# EAGLE schematic schematic-version5 - Jingbin (EAGLE 8.6.0)
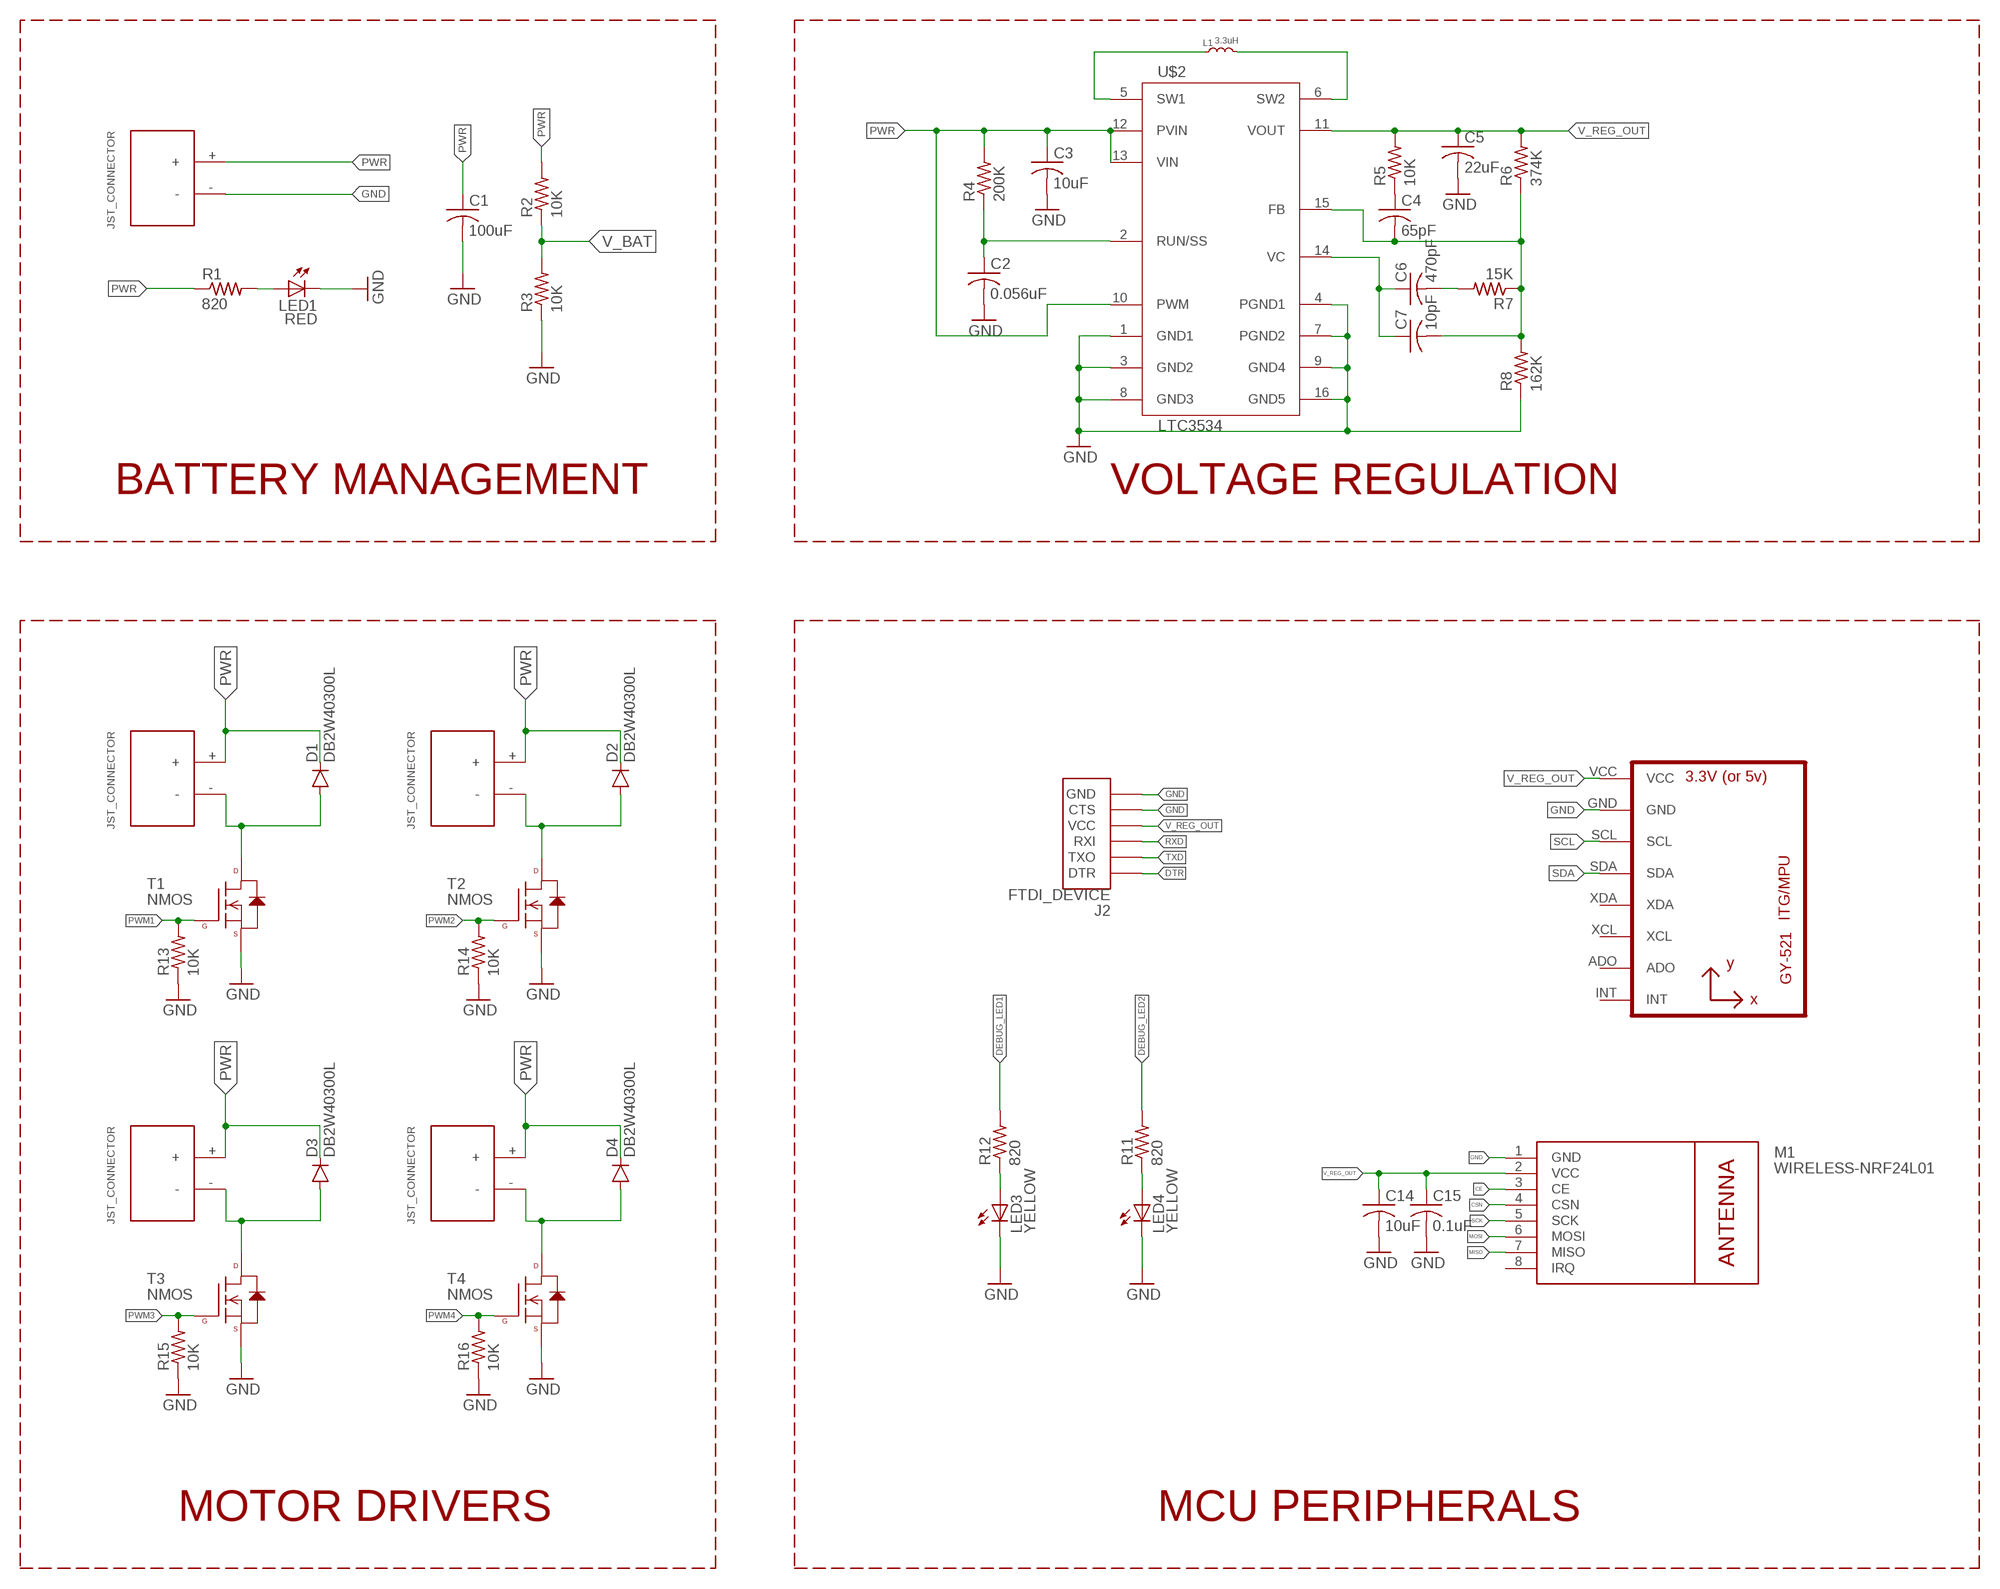
[diagram p0: schematic, sheet 1, part 1 of 2]
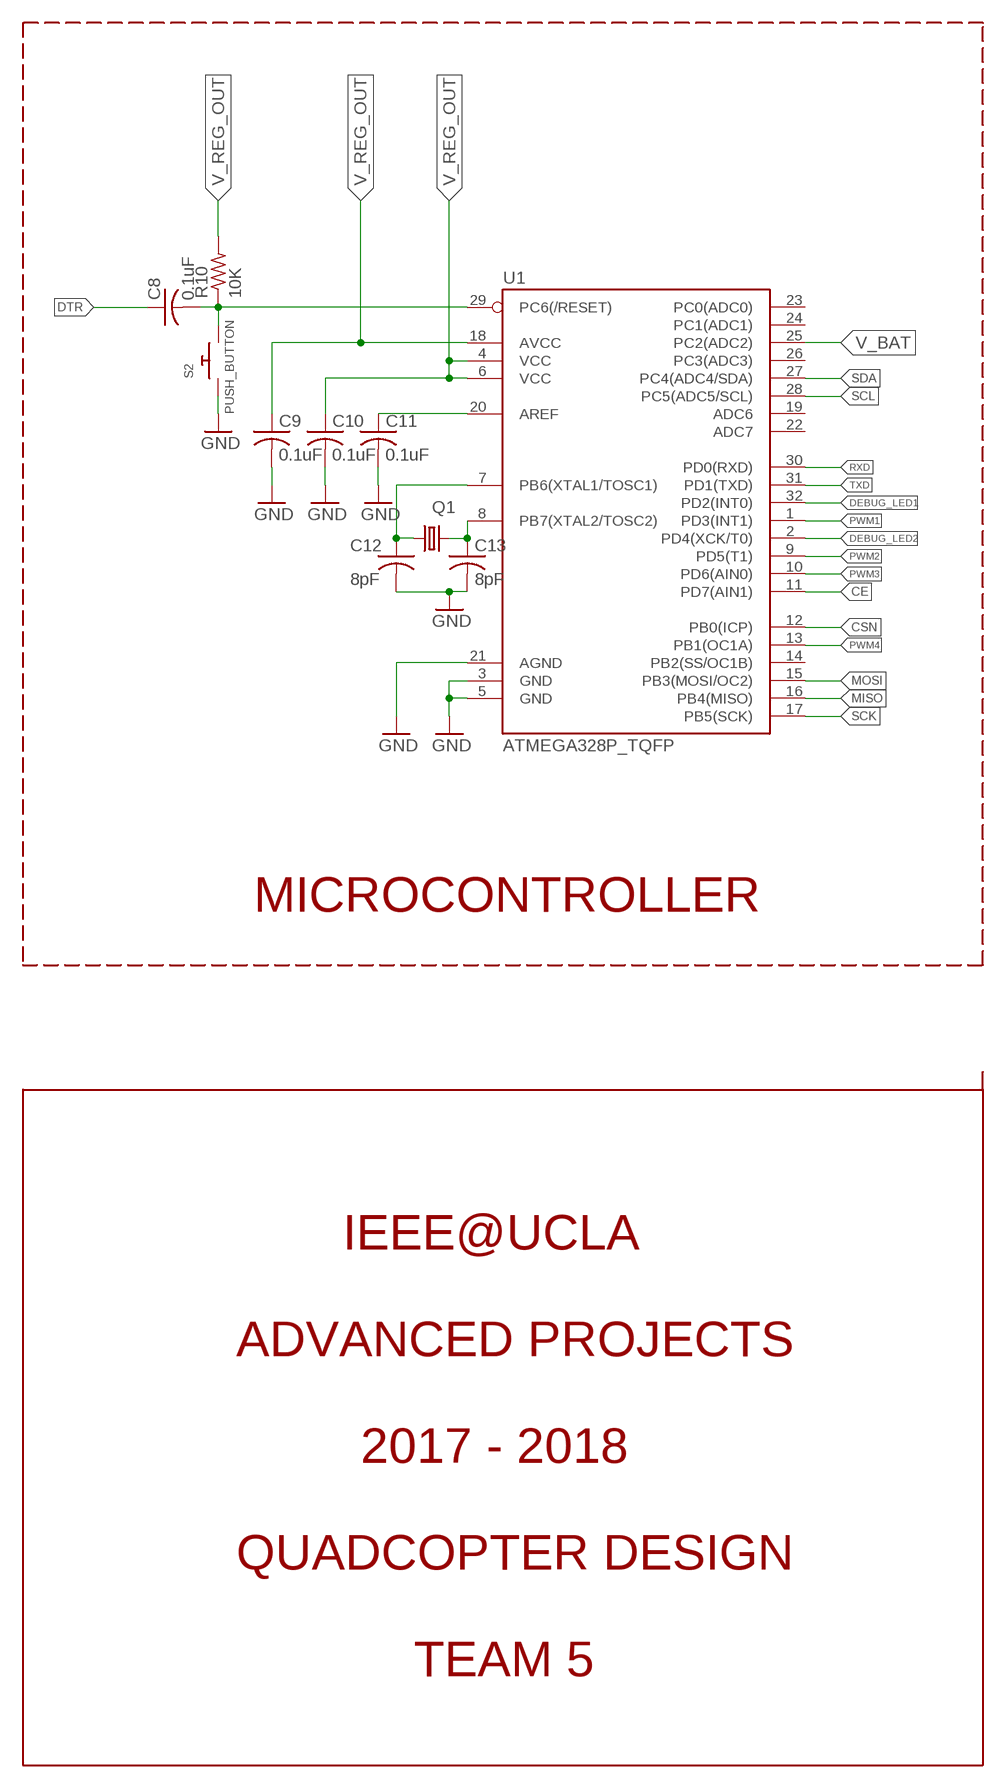
[diagram p1: schematic, sheet 1, part 2 of 2]

## Parts
C1  100uF  C-USC1210  [C1210]
C2  0.056uF  C-USC0603  [C0603]
C3  10uF  C-USC0603  [C0603]
C4  65pF  C-USC1206  [C1206]
C5  22uF  C-USC0603  [C0603]
C6  470pF  C-USC0603  [C0603]
C7  10pF  C-USC0603  [C0603]
C8  0.1uF  C-USC0603  [C0603]
C9  0.1uF  C-USC0603  [C0603]
C10  0.1uF  C-USC0603  [C0603]
C11  0.1uF  C-USC0603  [C0603]
C12  8pF  C-USC0603  [C0603]
C13  8pF  C-USC0603  [C0603]
C14  10uF  C-USC0603  [C0603]
C15  0.1uF  C-USC0603  [C0603]
D1  DB2W40300L  [MINI2-F3-B]
D2  DB2W40300L  [MINI2-F3-B]
D3  DB2W40300L  [MINI2-F3-B]
D4  DB2W40300L  [MINI2-F3-B]
J2  FTDI_DEVICE  [FTDI_DEVICE_SIDE]
L1  3.3uH  INDUCTOR.XAL4020  [XAL4020]
LED1  RED  LEDSML0603  [SML0603]
LED3  YELLOW  LEDSML0603  [SML0603]
LED4  YELLOW  LEDSML0603  [SML0603]
M1  WIRELESS-NRF24L01  [WIRELESS-NRF24L01]
Q1  NX3225GD  [NX3225GD-CRA-3]
R1  820  R-US_R0603  [R0603]
R2  10K  R-US_R0603  [R0603]
R3  10K  R-US_R0603  [R0603]
R4  200K  R-US_R0603  [R0603]
R5  10K  R-US_R0603  [R0603]
R6  374K  R-US_R0603  [R0603]
R7  15K  R-US_R0603  [R0603]
R8  162K  R-US_R0603  [R0603]
R10  10K  R-US_R0603  [R0603]
R11  820  R-US_R0603  [R0603]
R12  820  R-US_R0603  [R0603]
R13  10K  R-US_R0603  [R0603]
R14  10K  R-US_R0603  [R0603]
R15  10K  R-US_R0603  [R0603]
R16  10K  R-US_R0603  [R0603]
S2  PUSH_BUTTON  SWITCH_PUSHBUTTONSOFTTOUCHSMD_SJ  [PUSHBUTTON_SMD_SJ]
T1  NMOS  N-CHANNEL-MOSFET-IRLML6244TRPBF  [SOT23-3]
T2  NMOS  N-CHANNEL-MOSFET-IRLML6244TRPBF  [SOT23-3]
T3  NMOS  N-CHANNEL-MOSFET-IRLML6244TRPBF  [SOT23-3]
T4  NMOS  N-CHANNEL-MOSFET-IRLML6244TRPBF  [SOT23-3]
U1  ATMEGA328P_TQFP  [TQFP32-08]
U2  GY-521MPU6050  [GY-521]
U$1  JST_CONNECTOR_FEMALE  [JST_CONNECTOR_FEMALE]
U$2  LTC3534  [SSOP-16GN]
U$4  JST_CONNECTOR_FEMALE  [JST_CONNECTOR_FEMALE]
U$7  JST_CONNECTOR_FEMALE  [JST_CONNECTOR_FEMALE]
U$10  JST_CONNECTOR_FEMALE  [JST_CONNECTOR_FEMALE]
U$13  JST_CONNECTOR_FEMALE  [JST_CONNECTOR_FEMALE]

## Nets
CE: M1.3(CE) U1.11(PD7(AIN1))
CSN: M1.4(CSN) U1.12(PB0(ICP))
DEBUG_LED1: R12.2 U1.32(PD2(INT0))
DEBUG_LED2: R11.2 U1.2(PD4(XCK/T0))
DTR: C8.1 J2.P$1(DTR)
GND: C1.2 C2.2 C3.2 C5.2 C9.2 C10.2 C11.2 C12.2 C13.2 C14.2 C15.2 J2.P$5(CTS) J2.P$6(GND) LED1.C LED3.C LED4.C M1.1(GND) R3.1 R8.1 R13.1 R14.1 R15.1 R16.1 S2.P$1 T1.2(S) T2.2(S) T3.2(S) T4.2(S) U1.3(GND) U1.5(GND) U1.21(AGND) U2.GND U$1.- U$2.1(GND1) U$2.3(GND2) U$2.4(PGND1) U$2.7(PGND2) U$2.8(GND3) U$2.9(GND4) U$2.16(GND5)
MISO: M1.7(MISO) U1.16(PB4(MISO))
MOSI: M1.6(MOSI) U1.15(PB3(MOSI/OC2))
N$1: C12.1 Q1.P$1 U1.7(PB6(XTAL1/TOSC1))
N$2: C8.2 R10.1 S2.P$2 U1.29(PC6(/RESET))
N$3: D1.POS(PPIN) T1.3(D) U$4.-
N$4: C13.1 Q1.P$2 U1.8(PB7(XTAL2/TOSC2))
N$5: D2.POS(PPIN) T2.3(D) U$7.-
N$6: D3.POS(PPIN) T3.3(D) U$10.-
N$7: D4.POS(PPIN) T4.3(D) U$13.-
N$8: L1.1 U$2.5(SW1)
N$9: L1.2 U$2.6(SW2)
N$10: LED1.A R1.2
N$12: LED3.A R12.1
N$13: LED4.A R11.1
N$14: C4.1 R5.1
N$16: C2.1 R4.1 U$2.2(RUN/SS)
N$18: C4.2 C7.2 R6.1 R7.1 R8.2 U$2.15(FB)
N$19: C6.1 C7.1 U$2.14(VC)
N$20: C6.2 R7.2
N$25: C11.1 U1.20(AREF)
PWM1: R13.2 T1.1(G) U1.1(PD3(INT1))
PWM2: R14.2 T2.1(G) U1.9(PD5(T1))
PWM3: R15.2 T3.1(G) U1.10(PD6(AIN0))
PWM4: R16.2 T4.1(G) U1.13(PB1(OC1A))
PWR: C1.1 C3.1 D1.NEG(GPIN) D2.NEG(GPIN) D3.NEG(GPIN) D4.NEG(GPIN) R1.1 R2.2 R4.2 U$1.+ U$2.10(PWM) U$2.12(PVIN) U$2.13(VIN) U$4.+ U$7.+ U$10.+ U$13.+
RXD: J2.P$3(RXI) U1.30(PD0(RXD))
SCK: M1.5(SCK) U1.17(PB5(SCK))
SCL: U1.28(PC5(ADC5/SCL)) U2.SCL
SDA: U1.27(PC4(ADC4/SDA)) U2.SDA
TXD: J2.P$2(TXO) U1.31(PD1(TXD))
V_BAT: R2.1 R3.2 U1.25(PC2(ADC2))
V_REG_OUT: C5.1 C9.1 C10.1 C14.1 C15.1 J2.P$4(VCC) M1.2(VCC) R5.2 R6.2 R10.2 U1.4(VCC) U1.6(VCC) U1.18(AVCC) U2.VCC U$2.11(VOUT)
Unconnected: M1.8(IRQ) U1.14(PB2(SS/OC1B)) U1.19(ADC6) U1.22(ADC7) U1.23(PC0(ADC0)) U1.24(PC1(ADC1)) U1.26(PC3(ADC3)) U2.ADO U2.INT U2.XCL U2.XDA

## Notes on the sheet
- BATTERY MANAGEMENT | VOLTAGE REGULATION
- MICROCONTROLLER
- IEEE@UCLA
- ADVANCED PROJECTS
- 2017 - 2018
- QUADCOPTER DESIGN
- TEAM 5
- MOTOR DRIVERS | MCU PERIPHERALS

## Library data of the parts
C1 C4 C8-C11 = rcl:C-US: CAPACITOR, American symbol; SPICEPREFIX: C
C2 C3 C5-C7 C12-C15 = resistor:C-US: CAPACITOR, American symbol
D1-D4 = quad:DB2W40300L
J2 = quad:FTDI_DEVICE: Connector which mates to FTDI basic or FTDI cable.
L1 = coilcraft:INDUCTOR
LED1 LED3 LED4 = led:LED: LED OSRAM: - CHIPLED LG R971, LG N971, LY N971, LG Q971, LY Q971, LO R971, LY R971 LH N974, LH R974 LS Q976, LO Q976, LY Q976 LO Q996 - Hyper CHIPLED LW Q18S LB Q993, LB Q99A, LB R99A - SideLED LS A670, LO A670, LY A670, LG A670, LP A670 LB A673, LV A673, LT A673, LW A673 LH A674 LY A675 LS A676, LA A676, LO A676, LY A676, LW A676 LS A679, LY A679, LG A679 - Hyper Micro SIDELED® LS Y876, LA Y876, LO Y876, LY Y876 LT Y87S - SmartLED LW L88C, LW L88S LB L89C, LB L89S, LG L890 LS L89K, LO L89K, LY L89K LS L896, LA L896, LO L896, LY L896 - TOPLED LS T670, LO T670, LY T670, LG T670, LP T670 LSG T670, LSP T670, LSY T670, LOP T670, LYG T670 LG T671, LOG T671, LSG T671 LB T673, LV T673, LT T673, LW T673 LH T674 LS T676, LA T676, LO T676, LY T676, LB T676, LH T676, LSB T676, LW T676 LB T67C, LV T67C, LT T67C, LS T67K, LO T67K, LY T67K, LW E67C LS E67B, LA E67B, LO E67B, LY E67B, LB E67C, LV E67C, LT E67C LW T67C LS T679, LY T679, LG T679 LS T770, LO T770, LY T770, LG T770, LP T770 LB T773, LV T773, LT T773, LW T773 LH T774 LS E675, LA E675, LY E675, LS T675 LS T776, LA T776, LO T776, LY T776, LB T776 LHGB T686 LT T68C, LB T68C - Hyper Mini TOPLED® LB M676 - Mini TOPLED Santana® LG M470 LS M47K, LO M47K, LY M47K Source: http://www.osram.convergy.de LUXEON: - LUMILED® LXK2-PW12-R00, LXK2-PW12-S00, LXK2-PW14-U00, LXK2-PW14-V00 LXK2-PM12-R00, LXK2-PM12-S00, LXK2-PM14-U00 LXK2-PE12-Q00, LXK2-PE12-R00, LXK2-PE12-S00, LXK2-PE14-T00, LXK2-PE14-U00 LXK2-PB12-K00, LXK2-PB12-L00, LXK2-PB12-M00, LXK2-PB14-N00, LXK2-PB14-P00, LXK2-PB14-Q00 LXK2-PR12-L00, LXK2-PR12-M00, LXK2-PR14-Q00, LXK2-PR14-R00 LXK2-PD12-Q00, LXK2-PD12-R00, LXK2-PD12-S00 LXK2-PH12-R00, LXK2-PH12-S00 LXK2-PL12-P00, LXK2-PL12-Q00, LXK2-PL12-R00 Source: www.luxeon.com KINGBRIGHT: KA-3528ASYC Source: www.kingbright.com
M1 = quad:WIRELESS-NRF24L01: 2.4 GHz Wireless Module based on NRF24L01 chip
Q1 = NDK:NX3225GD
R1 R11 R12 = rcl:R-US_: RESISTOR, American symbol; SPICEPREFIX: R
R2-R8 R10 R13-R16 = resistor:R-US_: RESISTOR, American symbol
S2 = adafruit:SWITCH_PUSHBUTTON: Buttons SOFTTOUCHSMD_SJ - Soft touch temporary push button (Super Junk Akihabara) Compatible with SKPMANE010 [Mouser: 688-SKPMAN] C&K_KSS = Digikey: KSS221GLFS
T1-T4 = quad:N-CHANNEL-MOSFET: N-Channel MOSFET Mode Field Effect Transistor; DATASHEET: http://www.mouser.com/ds/2/196/irlml6244pbf-936666.pdf; MOUSER: 942-IRLML6244TRPBF; URL: http://www.mouser.com/Search/ProductDetail.aspx?R=IRLML6244TRPBFvirtualkey57370000virtualkey942-IRLML6244TRPBF
U1 = quad:ATMEGA328P_TQFP; PROD_ID: IC-09069
U2 = quad:GY-521
U$1 U$4 U$7 U$10 U$13 = quad:JST_CONNECTOR_FEMALE
U$2 = LTC3534:LTC3534